# EasyEDA Pro project devboard.epro, schematic Cartridge

## Sheets
1 Cartridge 1: Create Date: 2024-07-21; Page Name: Cartridge 1; Project Name: RCKid2; Schematic Name: Schematic1; Update Date: 2024-07-21; Company: EasyEDA.com; Drawn: EasyEDA; Page Size: A4; Part Number: JLCPCB-002; Reviewed: EasyEDA; Version: V0.1
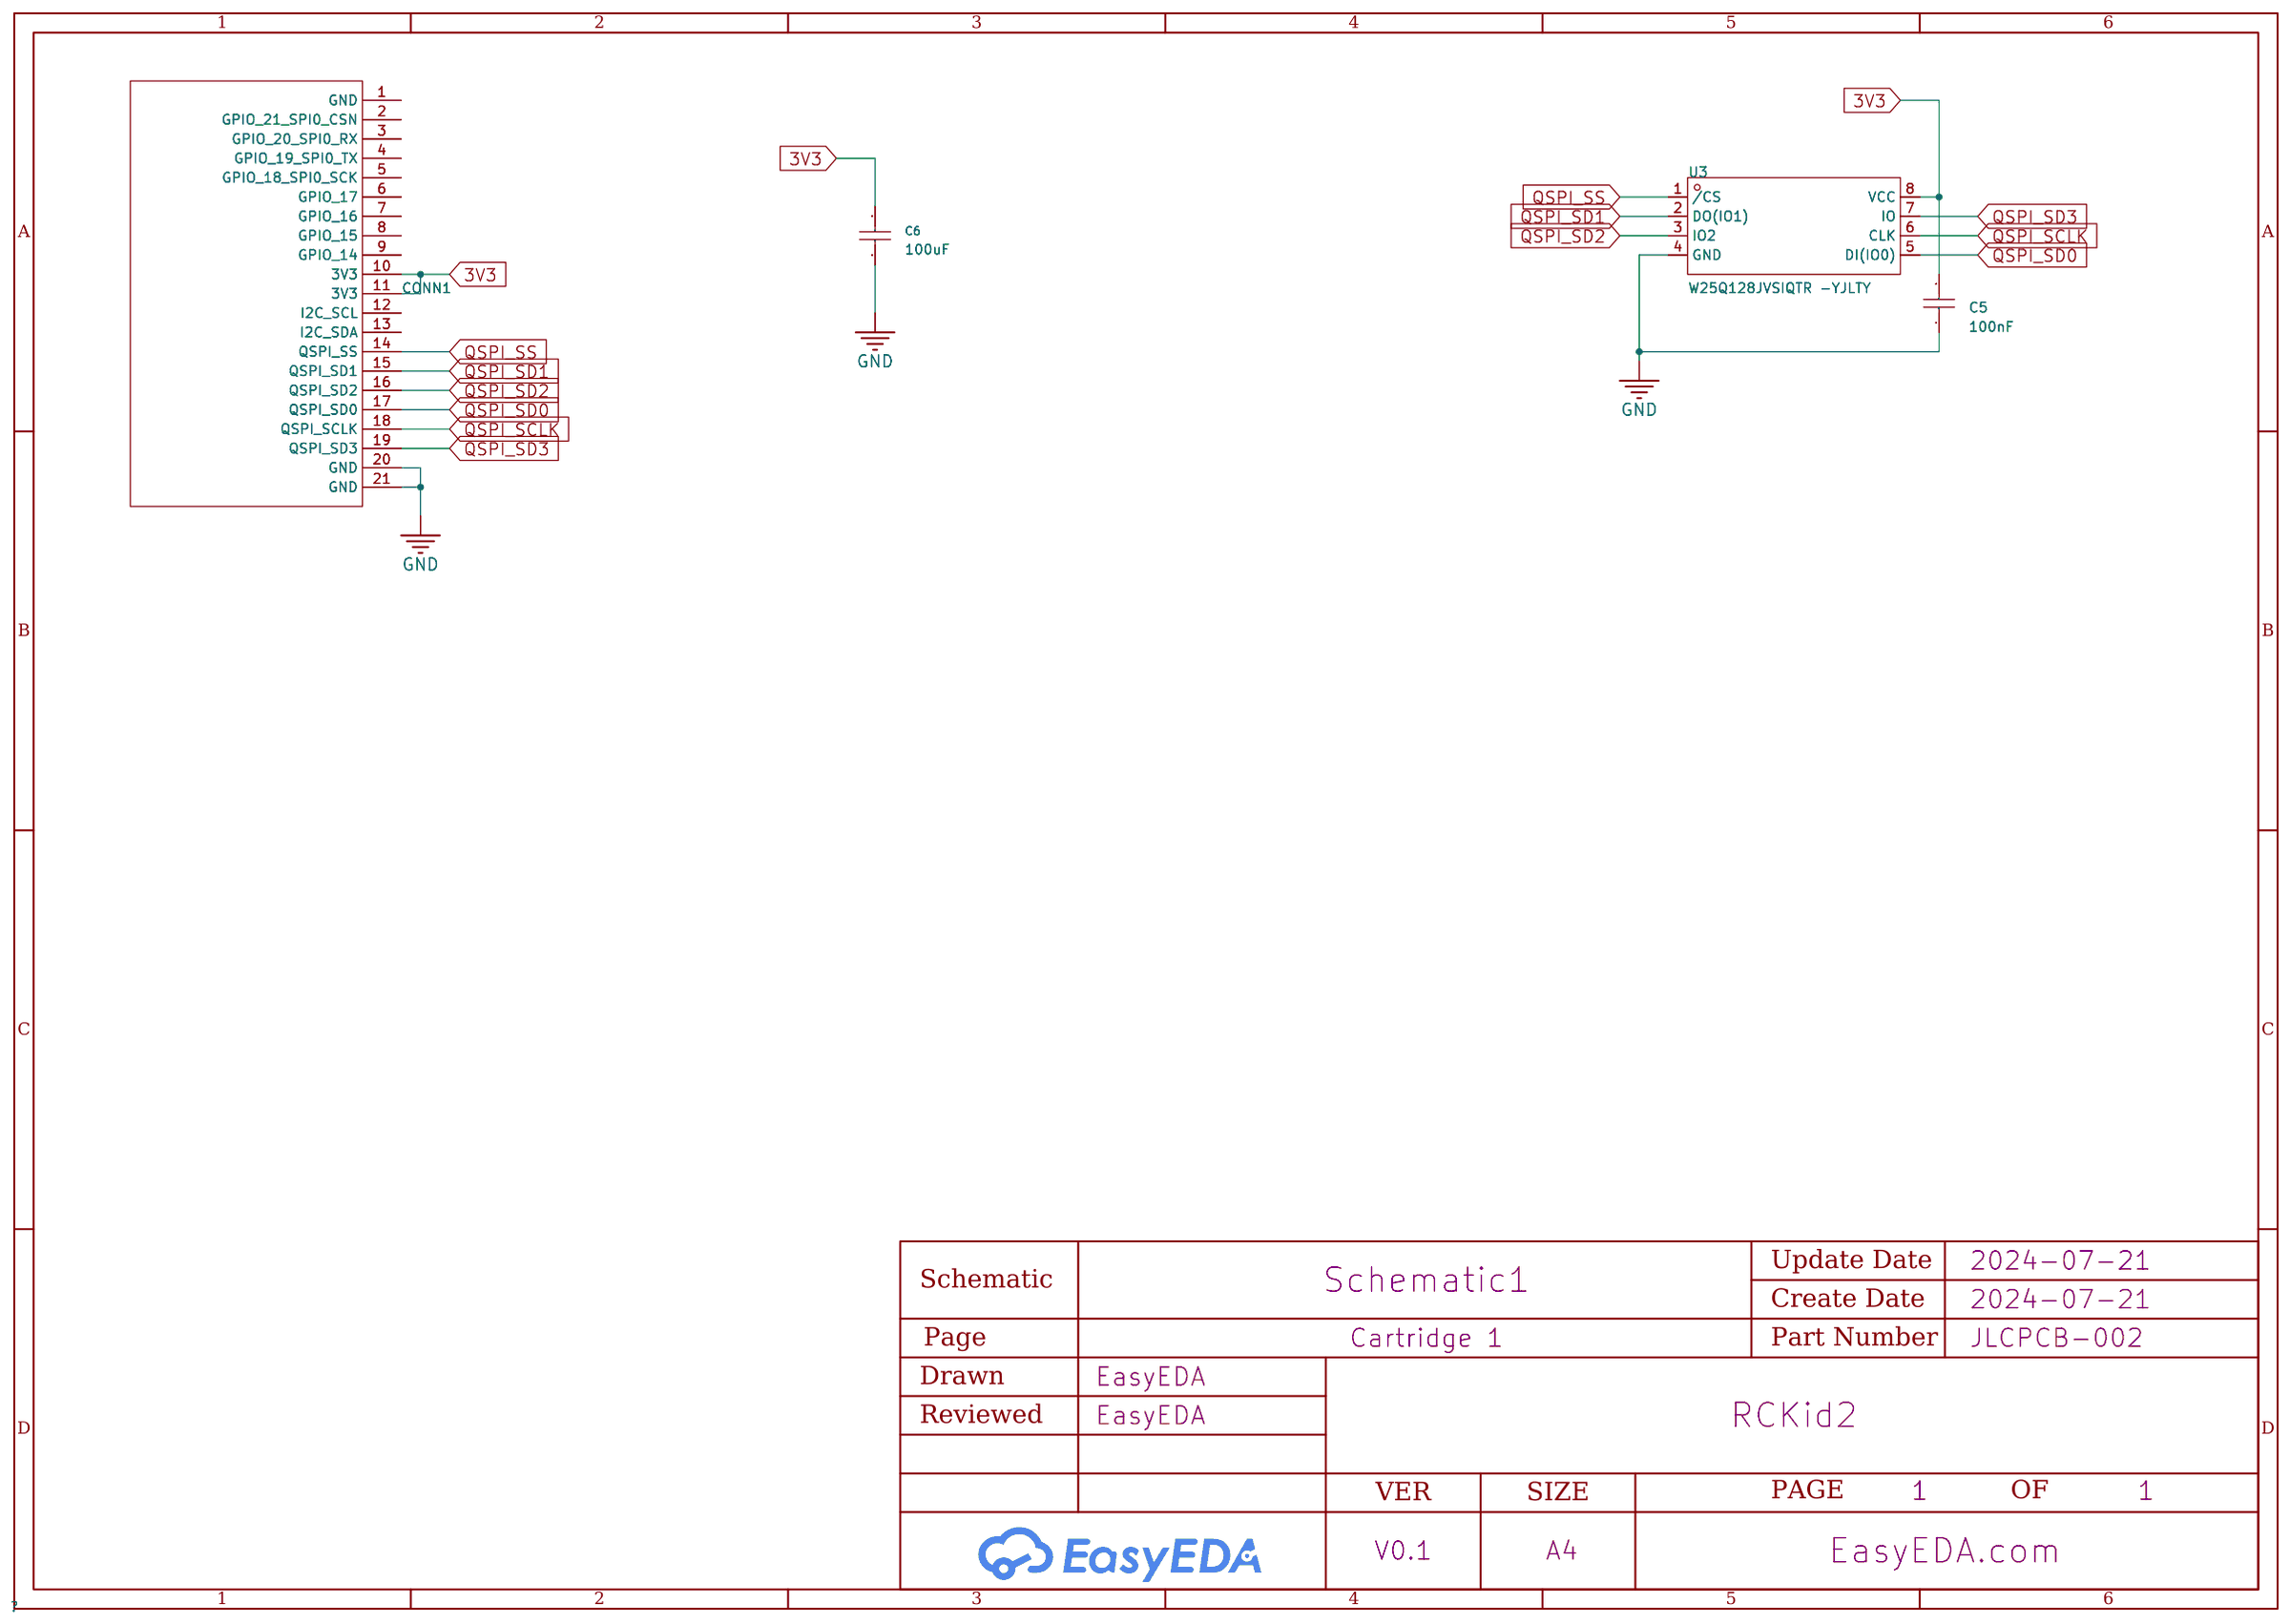
[diagram p0: Cartridge 1]
2 Cartridge 2: Page Name: Cartridge 2; Schematic Name: Cartridge
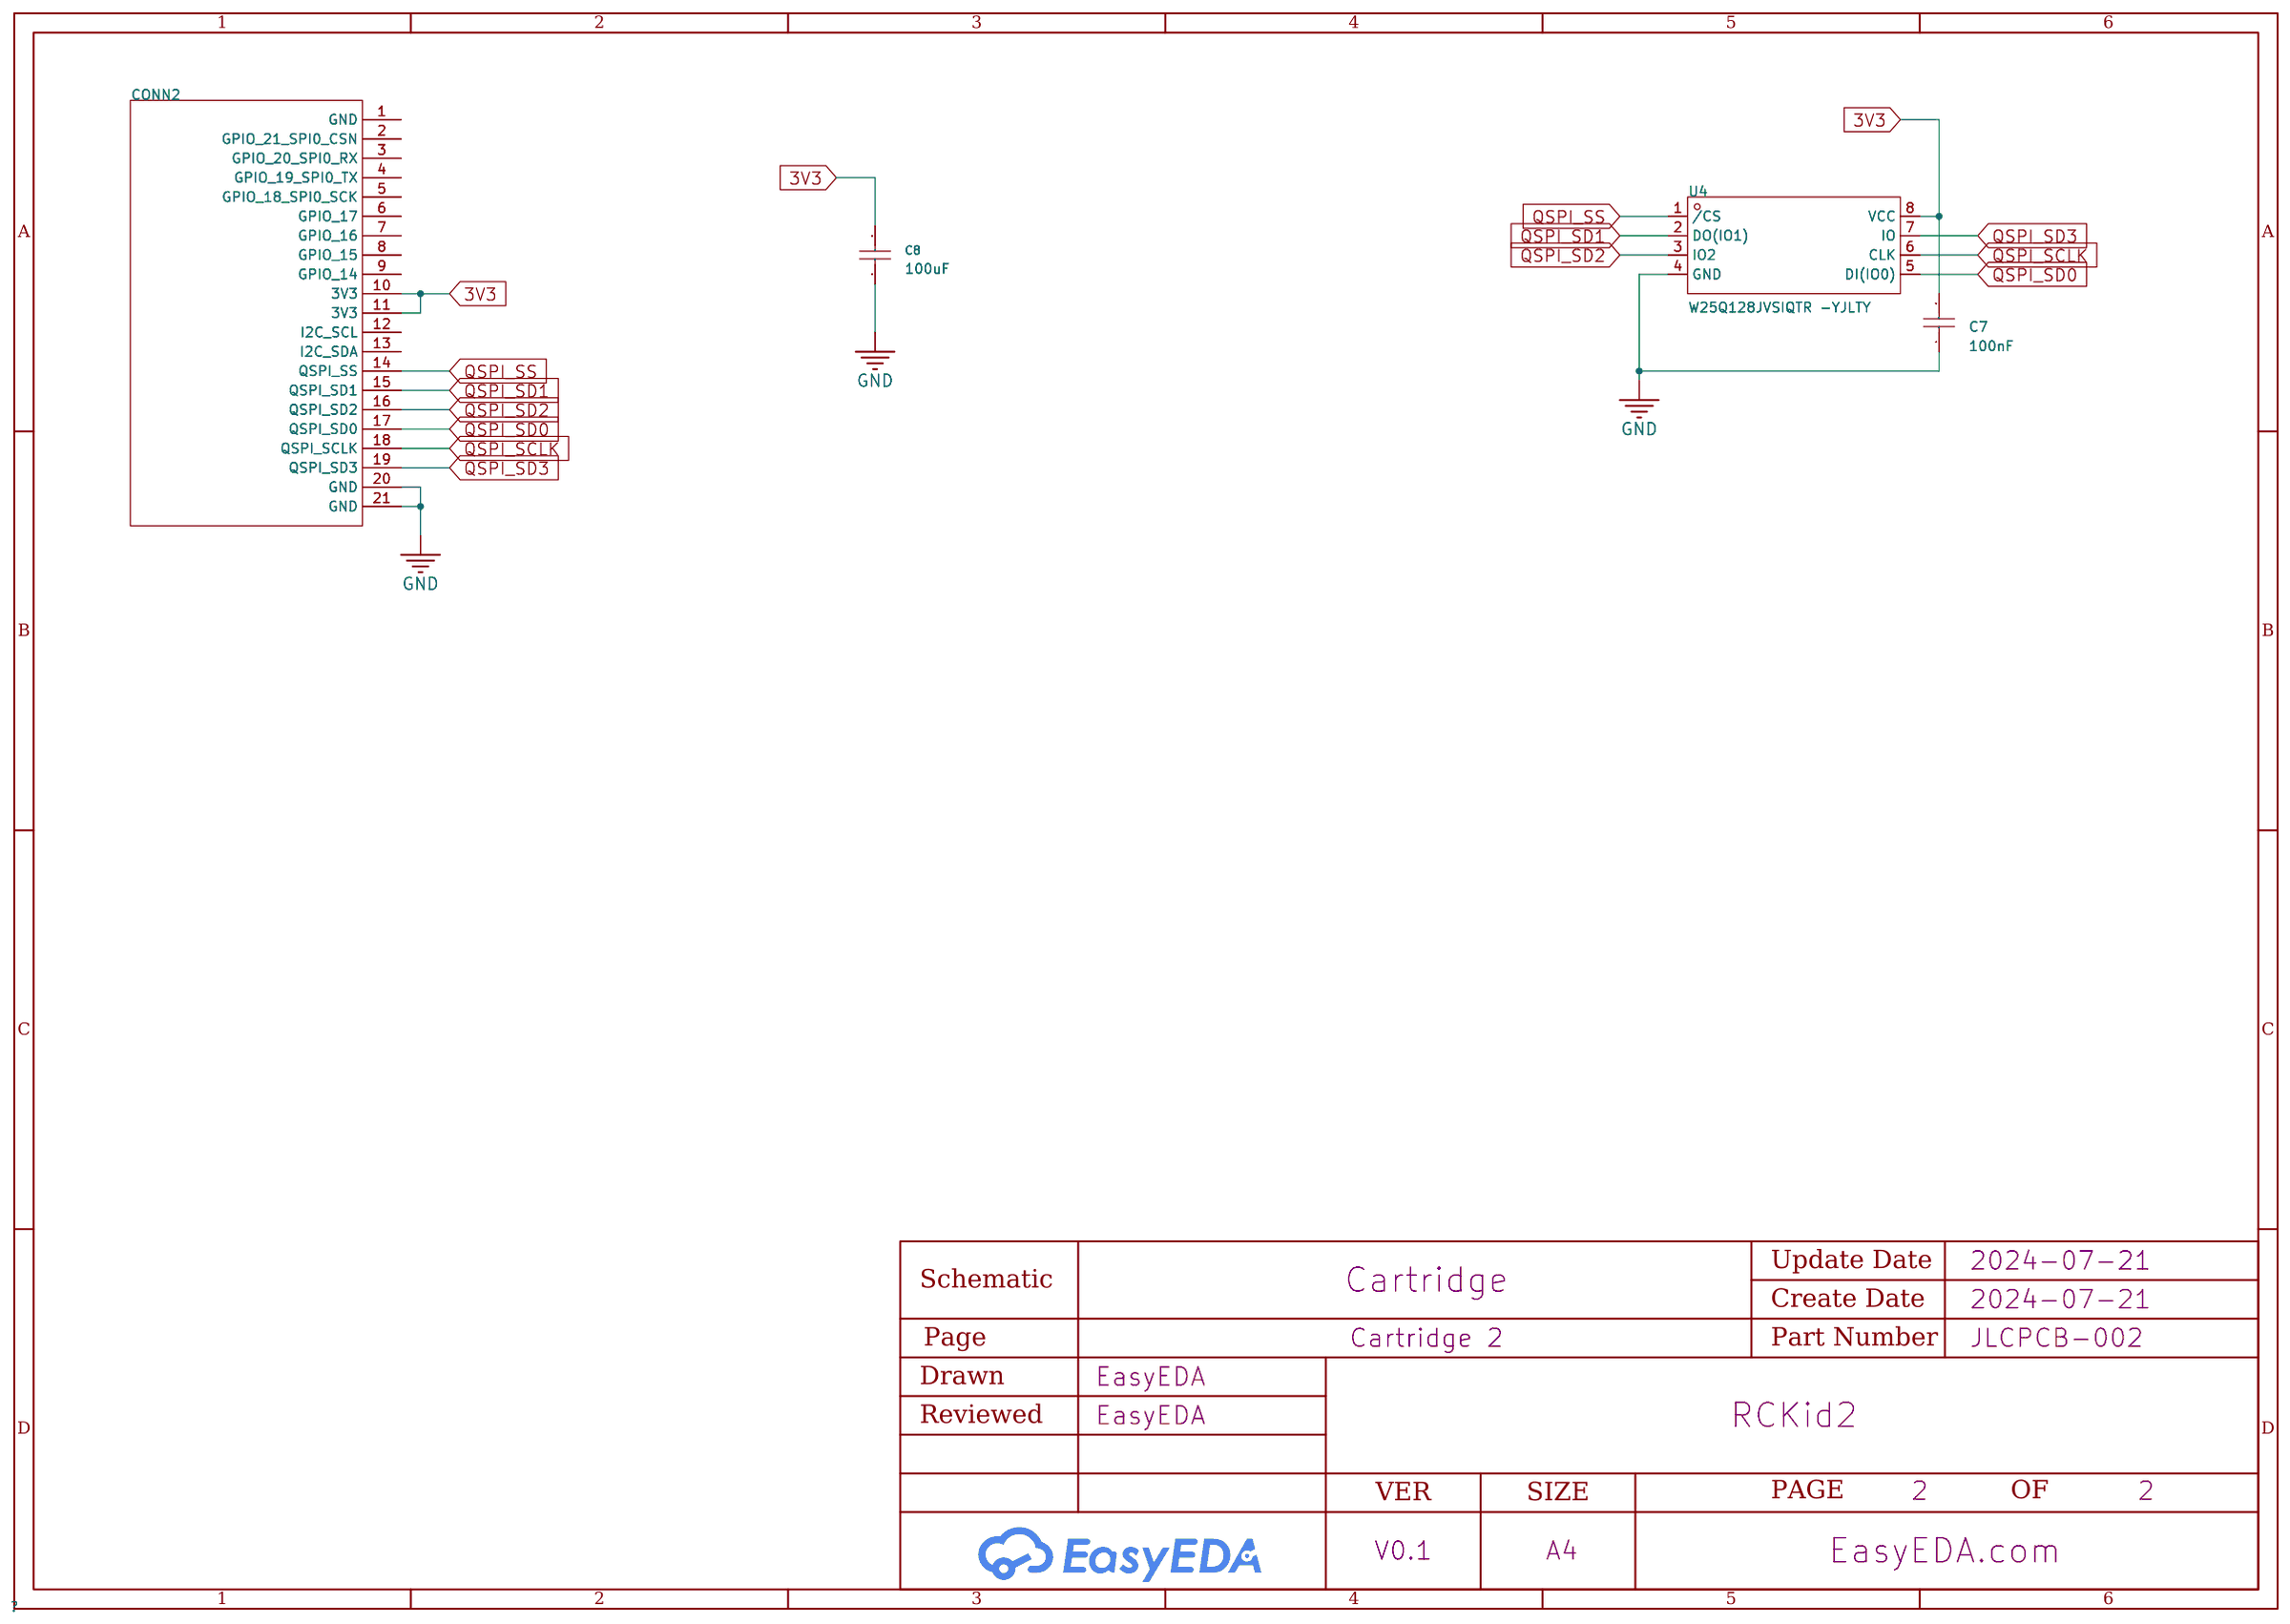
[diagram p1: Cartridge 2]
3 Cartridge 3: Page Name: Cartridge 3; Schematic Name: Cartridge
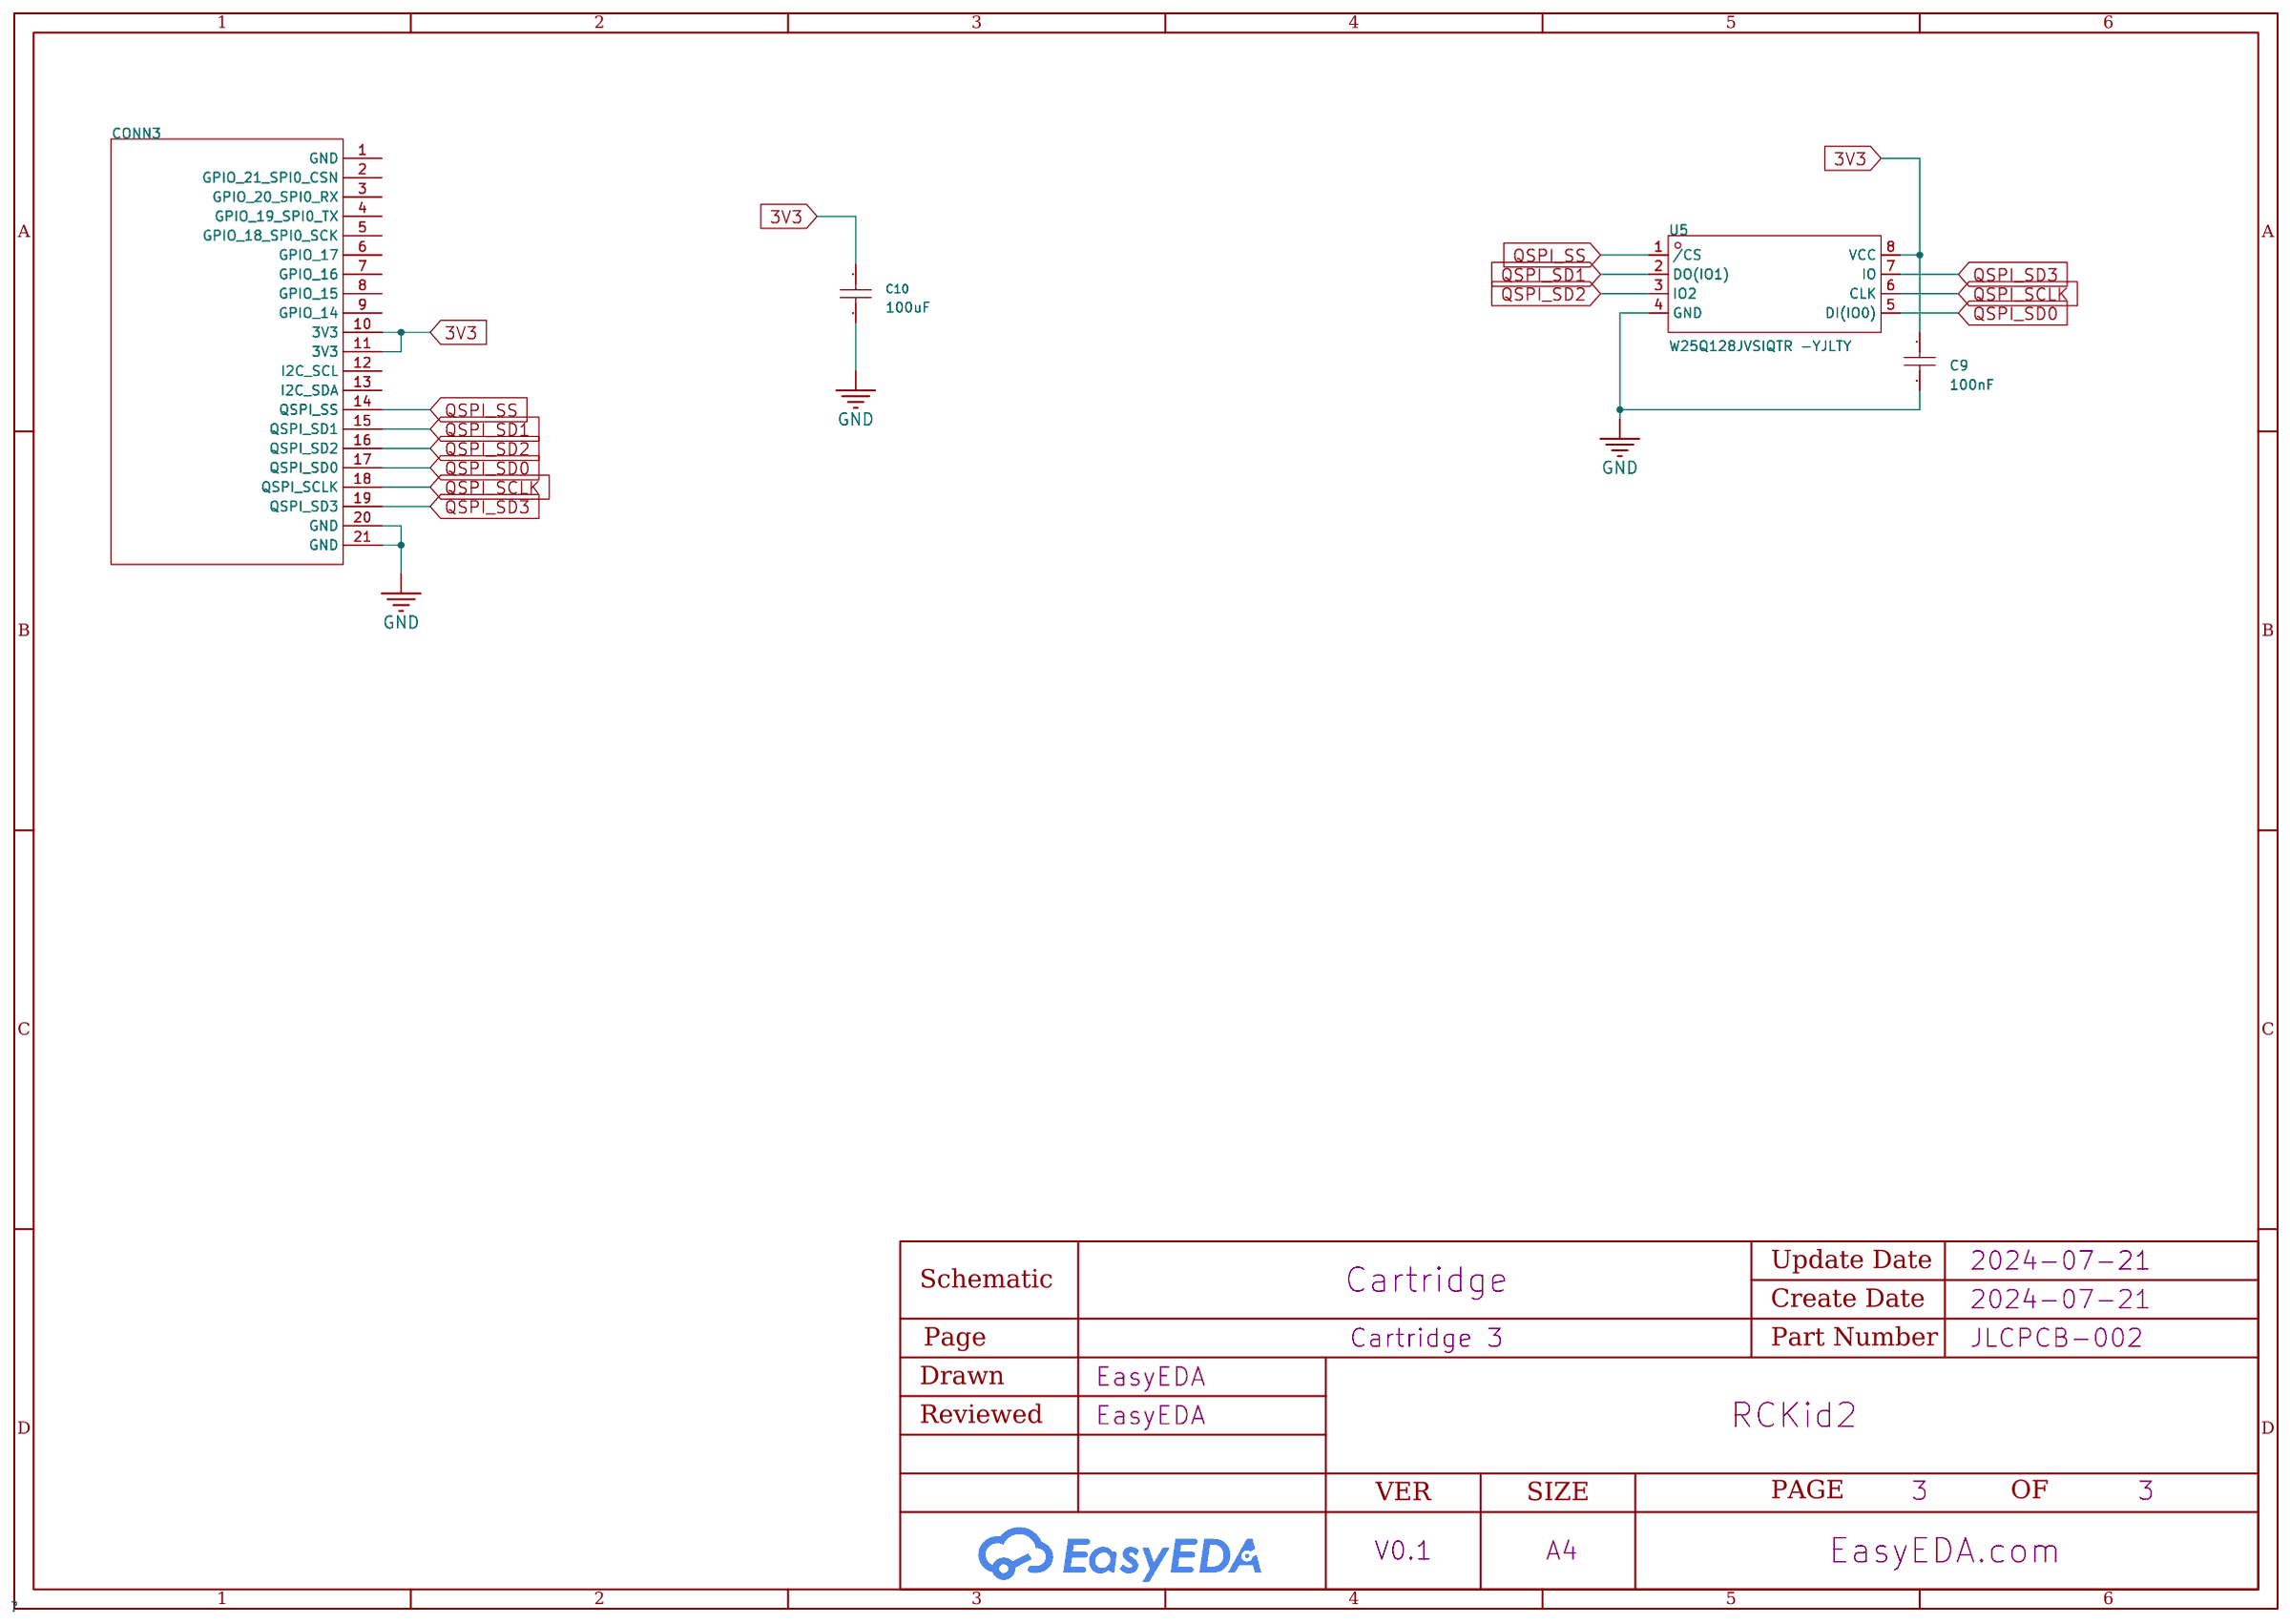
[diagram p2: Cartridge 3]

## Parts
sheet Cartridge 1
C5  100nF  [C0805]
C6  100uF  [C1206]
CONN1  -  [RCKid Cartridge Pins]
U3  W25Q128JVSIQTR -YJLTY  [SOIC-8_L5.3-W5.3-P1.27-LS8.0-BL]
sheet Cartridge 2
C7  100nF  [C0805]
C8  100uF  [C1206]
CONN2  -  [RCKid Cartridge Pins]
U4  W25Q128JVSIQTR -YJLTY  [SOIC-8_L5.3-W5.3-P1.27-LS8.0-BL]
sheet Cartridge 3
C9  100nF  [C0805]
C10  100uF  [C1206]
CONN3  -  [RCKid Cartridge Pins]
U5  W25Q128JVSIQTR -YJLTY  [SOIC-8_L5.3-W5.3-P1.27-LS8.0-BL]

## Library data of the parts
C5 C7 C9 = CL21B104KCFNNNE: Capacitance: Tolerance:±10% Tolerance:±10% Voltage Rated: Temperature Coefficient:; LCSC Part Name: 100nF ±10% 100V; Supplier Part: C28233; Manufacturer: SAMSUNG(三星); Supplier Footprint: 0805; JLCPCB Part Class: Basic Part; Datasheet: https://atta.szlcsc.com/upload/public/pdf/source/20160103/1457707716102.pdf; Supplier: LCSC; Tolerance: ±10%
C6 C8 C10 = CL31A107MQHNNNE: Capacitance: Tolerance:±20% Tolerance:±20% Voltage Rated: Temperature Coefficient:; LCSC Part Name: 100uF±20%6.3V; Supplier Part: C15008; Manufacturer: SAMSUNG(三星); Supplier Footprint: 1206; JLCPCB Part Class: BasicPart; Datasheet: https://atta.szlcsc.com/upload/public/pdf/source/20160103/1457707673200.pdf; Supplier: LCSC; Tolerance: ±20%
CONN1-CONN3 = RCKid2 Cartridge Connector
U3-U5 = W25Q128JVSIQTR -YJLTY: LCSC Part Name: 串行闪存; Supplier Part: C2921483; Manufacturer: WINBOND(华邦); Supplier Footprint: SOIC-8-208mil; JLCPCB Part Class: Extended Part; Datasheet: 2021-11-15/642689F/b4c28fe9be624f43904f2fc1db378149/STM32F429IGT6.pdf; Supplier: LCSC

## Nets
3V3: C5.2 C6.2 C7.2 C8.2 C9.2 C10.2 CONN1.10(3V3) CONN1.11(3V3) CONN2.10(3V3) CONN2.11(3V3) CONN3.10(3V3) CONN3.11(3V3) U3.8(VCC) U4.8(VCC) U5.8(VCC)
GND: C5.1 C6.1 C7.1 C8.1 C9.1 C10.1 CONN1.20(GND) CONN1.21(GND) CONN2.20(GND) CONN2.21(GND) CONN3.20(GND) CONN3.21(GND) U3.4(GND) U4.4(GND) U5.4(GND)
QSPI_SCLK: CONN1.18(QSPI_SCLK) CONN2.18(QSPI_SCLK) CONN3.18(QSPI_SCLK) U3.6(CLK) U4.6(CLK) U5.6(CLK)
QSPI_SD0: CONN1.17(QSPI_SD0) CONN2.17(QSPI_SD0) CONN3.17(QSPI_SD0) U3.5(DI(IO0)) U4.5(DI(IO0)) U5.5(DI(IO0))
QSPI_SD1: CONN1.15(QSPI_SD1) CONN2.15(QSPI_SD1) CONN3.15(QSPI_SD1) U3.2(DO(IO1)) U4.2(DO(IO1)) U5.2(DO(IO1))
QSPI_SD2: CONN1.16(QSPI_SD2) CONN2.16(QSPI_SD2) CONN3.16(QSPI_SD2) U3.3(IO2) U4.3(IO2) U5.3(IO2)
QSPI_SD3: CONN1.19(QSPI_SD3) CONN2.19(QSPI_SD3) CONN3.19(QSPI_SD3) U3.7(IO) U4.7(IO) U5.7(IO)
QSPI_SS: CONN1.14(QSPI_SS) CONN2.14(QSPI_SS) CONN3.14(QSPI_SS) U3.1(/CS) U4.1(/CS) U5.1(/CS)

Not connected (* = marked no-connect by the designer): CONN1 1(GND) 2(GPIO_21_SPI0_CSN) 3(GPIO_20_SPI0_RX) 4(GPIO_19_SPI0_TX) 5(GPIO_18_SPI0_SCK) 6(GPIO_17) 7(GPIO_16) 8(GPIO_15) 9(GPIO_14) 12(I2C_SCL) 13(I2C_SDA); CONN2 1(GND) 2(GPIO_21_SPI0_CSN) 3(GPIO_20_SPI0_RX) 4(GPIO_19_SPI0_TX) 5(GPIO_18_SPI0_SCK) 6(GPIO_17) 7(GPIO_16) 8(GPIO_15) 9(GPIO_14) 12(I2C_SCL) 13(I2C_SDA); CONN3 1(GND) 2(GPIO_21_SPI0_CSN) 3(GPIO_20_SPI0_RX) 4(GPIO_19_SPI0_TX) 5(GPIO_18_SPI0_SCK) 6(GPIO_17) 7(GPIO_16) 8(GPIO_15) 9(GPIO_14) 12(I2C_SCL) 13(I2C_SDA)
